# EAGLE design WaterbedSlave (EAGLE 9.1.3)
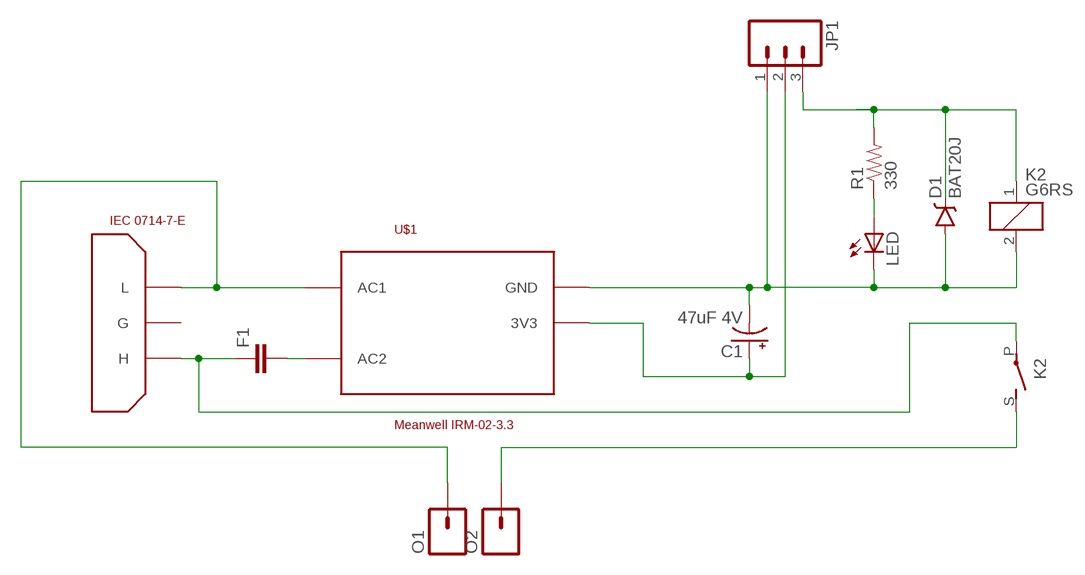
[diagram p0: schematic, sheet 1]

## Parts
C1  47uF 4V  CAP_POLPTH2  [CPOL-RADIAL-10UF-25V]
D1  BAT20J  DIODE-SCHOTTKY-BAT20J  [SOD-323]
F1  CAPPTH1  [CAP-PTH-5MM]
JP1  M03POLAR_LOCK  [MOLEX-1X3_LOCK]
K2  G6RS  [G6RS]
LED  LEDCHIPLED_0805  [CHIPLED_0805]
O1  M01PTH_2MM  [1X01_2MM]
O2  M01PTH_2MM  [1X01_2MM]
R1  330  RESISTOR0805-RES  [0805]
U$1  Meanwell IRM-02-3.3  RAC02-3.3SC  [RAC02-3.3SC]
U$3  IEC 0714-7-E  IEC  [IEC]

## Nets
3V3: C1.1(+) JP1.2 U$1.GND(3V3)
GND: C1.2(-) D1.A JP1.1 K2.2 LED.C U$1.3V3(GND)
N$1: O1.1 U$1.AC1 U$3.L
N$2: F1.2 U$1.AC2
N$3: K2.S(2:S) O2.1
N$4: F1.1 K2.P(2:P) U$3.H
N$10: LED.A R1.1
N$16: D1.C JP1.3 K2.1 R1.2
Unconnected: U$3.G

## Library data of the parts
C1 = SparkFun-Capacitors:CAP_POL: Capacitor Polarized These are standard SMD and PTH capacitors. Normally 10uF, 47uF, and 100uF in electrolytic and tantalum varieties. Always verify the external diameter of the through hole cap, it varies with capacity, voltage, and manufacturer. The EIA devices should be standard.
D1 = SparkFun-DiscreteSemi:DIODE-SCHOTTKY: Schottky diodes in SFE's production catalog BAT20J 1A 23V 0.62Vf RB751 120mA 40V 0.37Vf PMEG4005EJ 0.5A 40V 0.42Vf MBRA140 1A 40V 0.5Vf B340A 3A 40V SMA; PROD_ID: DIO-11623
F1 = SparkFun-Capacitors:CAP: Capacitor Standard 0603 ceramic capacitor, and 0.1" leaded capacitor.
JP1 = SparkFun-Connectors:M03: Header 3 Standard 3-pin 0.1" header. Use with straight break away headers (SKU : PRT-00116), right angle break away headers (PRT-00553), swiss pins (PRT-00743), machine pins (PRT-00117), and female headers (PRT-00115). Molex polarized connector foot print use with SKU : PRT-08232 with associated crimp pins and housings.
K2 = relay:G6RS: RELAY 1 x norm. open, Omron; OC_FARNELL: unknown; OC_NEWARK: unknown
LED = led:LED: LED OSRAM: - CHIPLED LG R971, LG N971, LY N971, LG Q971, LY Q971, LO R971, LY R971 LH N974, LH R974 LS Q976, LO Q976, LY Q976 LO Q996 - Hyper CHIPLED LW Q18S LB Q993, LB Q99A, LB R99A - SideLED LS A670, LO A670, LY A670, LG A670, LP A670 LB A673, LV A673, LT A673, LW A673 LH A674 LY A675 LS A676, LA A676, LO A676, LY A676, LW A676 LS A679, LY A679, LG A679 - Hyper Micro SIDELED® LS Y876, LA Y876, LO Y876, LY Y876 LT Y87S - SmartLED LW L88C, LW L88S LB L89C, LB L89S, LG L890 LS L89K, LO L89K, LY L89K LS L896, LA L896, LO L896, LY L896 - TOPLED LS T670, LO T670, LY T670, LG T670, LP T670 LSG T670, LSP T670, LSY T670, LOP T670, LYG T670 LG T671, LOG T671, LSG T671 LB T673, LV T673, LT T673, LW T673 LH T674 LS T676, LA T676, LO T676, LY T676, LB T676, LH T676, LSB T676, LW T676 LB T67C, LV T67C, LT T67C, LS T67K, LO T67K, LY T67K, LW E67C LS E67B, LA E67B, LO E67B, LY E67B, LB E67C, LV E67C, LT E67C LW T67C LS T679, LY T679, LG T679 LS T770, LO T770, LY T770, LG T770, LP T770 LB T773, LV T773, LT T773, LW T773 LH T774 LS E675, LA E675, LY E675, LS T675 LS T776, LA T776, LO T776, LY T776, LB T776 LHGB T686 LT T68C, LB T68C - Hyper Mini TOPLED® LB M676 - Mini TOPLED Santana® LG M470 LS M47K, LO M47K, LY M47K Source: http://www.osram.convergy.de LUXEON: - LUMILED® LXK2-PW12-R00, LXK2-PW12-S00, LXK2-PW14-U00, LXK2-PW14-V00 LXK2-PM12-R00, LXK2-PM12-S00, LXK2-PM14-U00 LXK2-PE12-Q00, LXK2-PE12-R00, LXK2-PE12-S00, LXK2-PE14-T00, LXK2-PE14-U00 LXK2-PB12-K00, LXK2-PB12-L00, LXK2-PB12-M00, LXK2-PB14-N00, LXK2-PB14-P00, LXK2-PB14-Q00 LXK2-PR12-L00, LXK2-PR12-M00, LXK2-PR14-Q00, LXK2-PR14-R00 LXK2-PD12-Q00, LXK2-PD12-R00, LXK2-PD12-S00 LXK2-PH12-R00, LXK2-PH12-S00 LXK2-PL12-P00, LXK2-PL12-Q00, LXK2-PL12-R00 Source: www.luxeon.com KINGBRIGHT: KA-3528ASYC Source: www.kingbright.com
O1 O2 = SparkFun-Connectors:M01: Header 1 Standard 1-pin 0.1" header. Use with straight break away headers (SKU : PRT-00116), right angle break away headers (PRT-00553), swiss pins (PRT-00743), machine pins (PRT-00117), and female headers (PRT-00115).
R1 = SparkFun-Resistors:RESISTOR: Resistor Basic schematic elements and footprints for 0603, 1206, and PTH resistors.
U$1 = CuriousTech:RAC02-3.3SC: RAC02-3.3SC
U$3 = CuriousTech:IEC: IEC Female

## Board
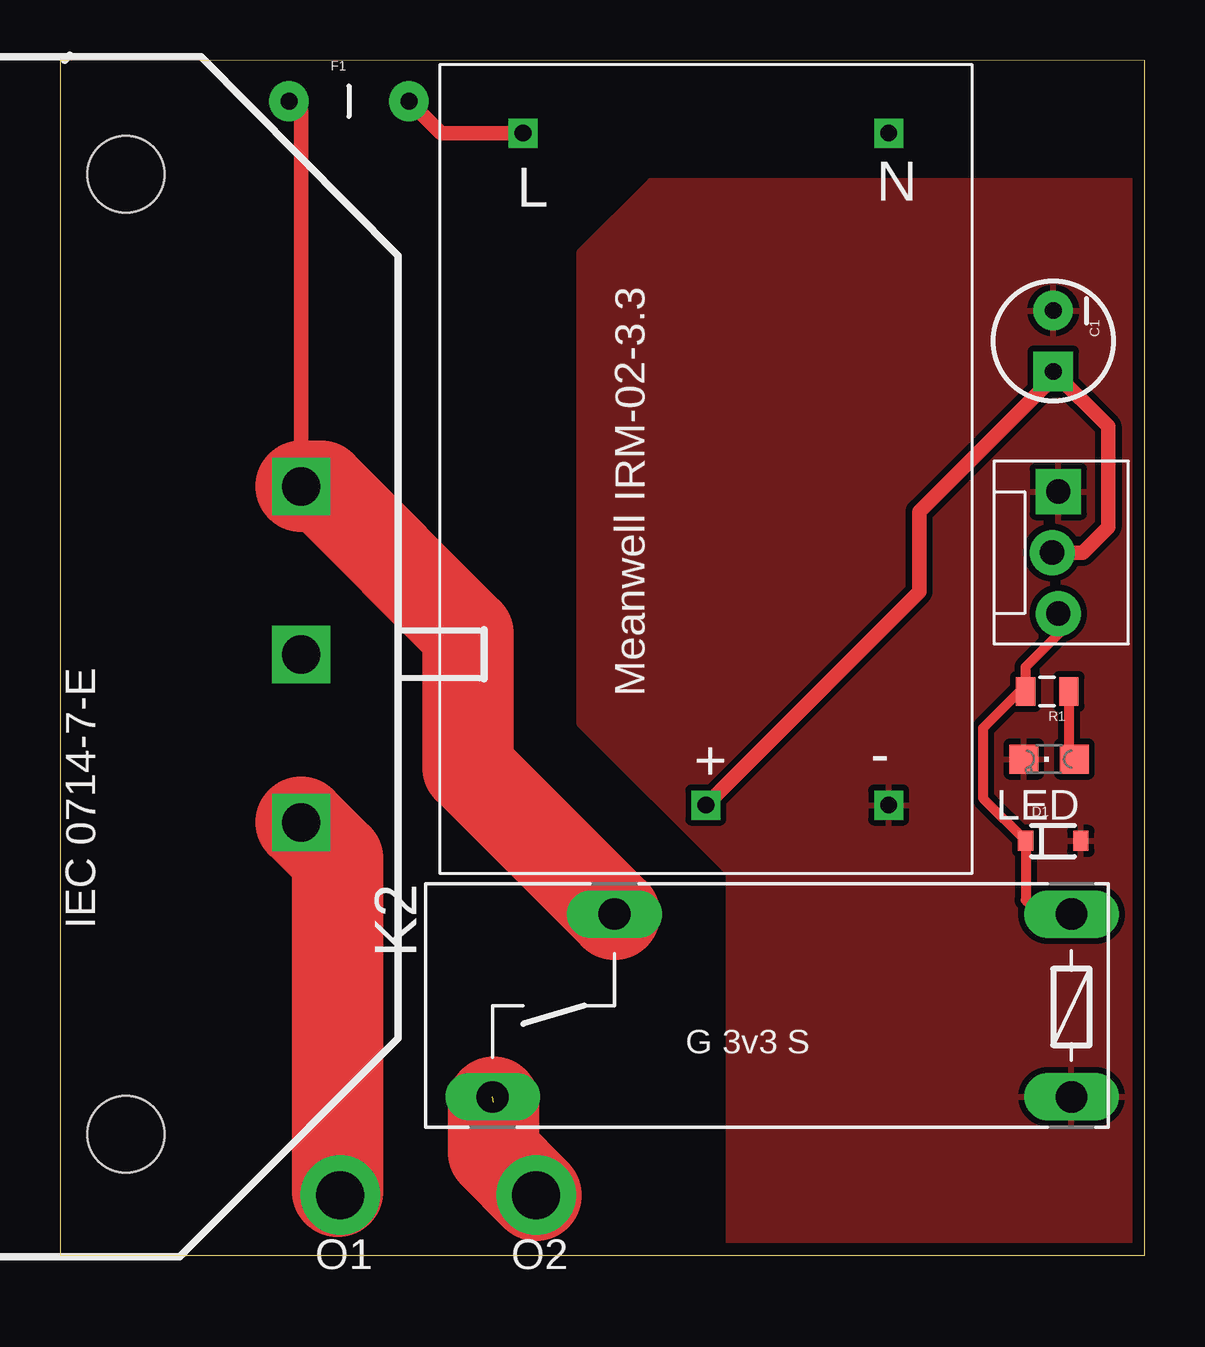
[diagram p1: board, top side]
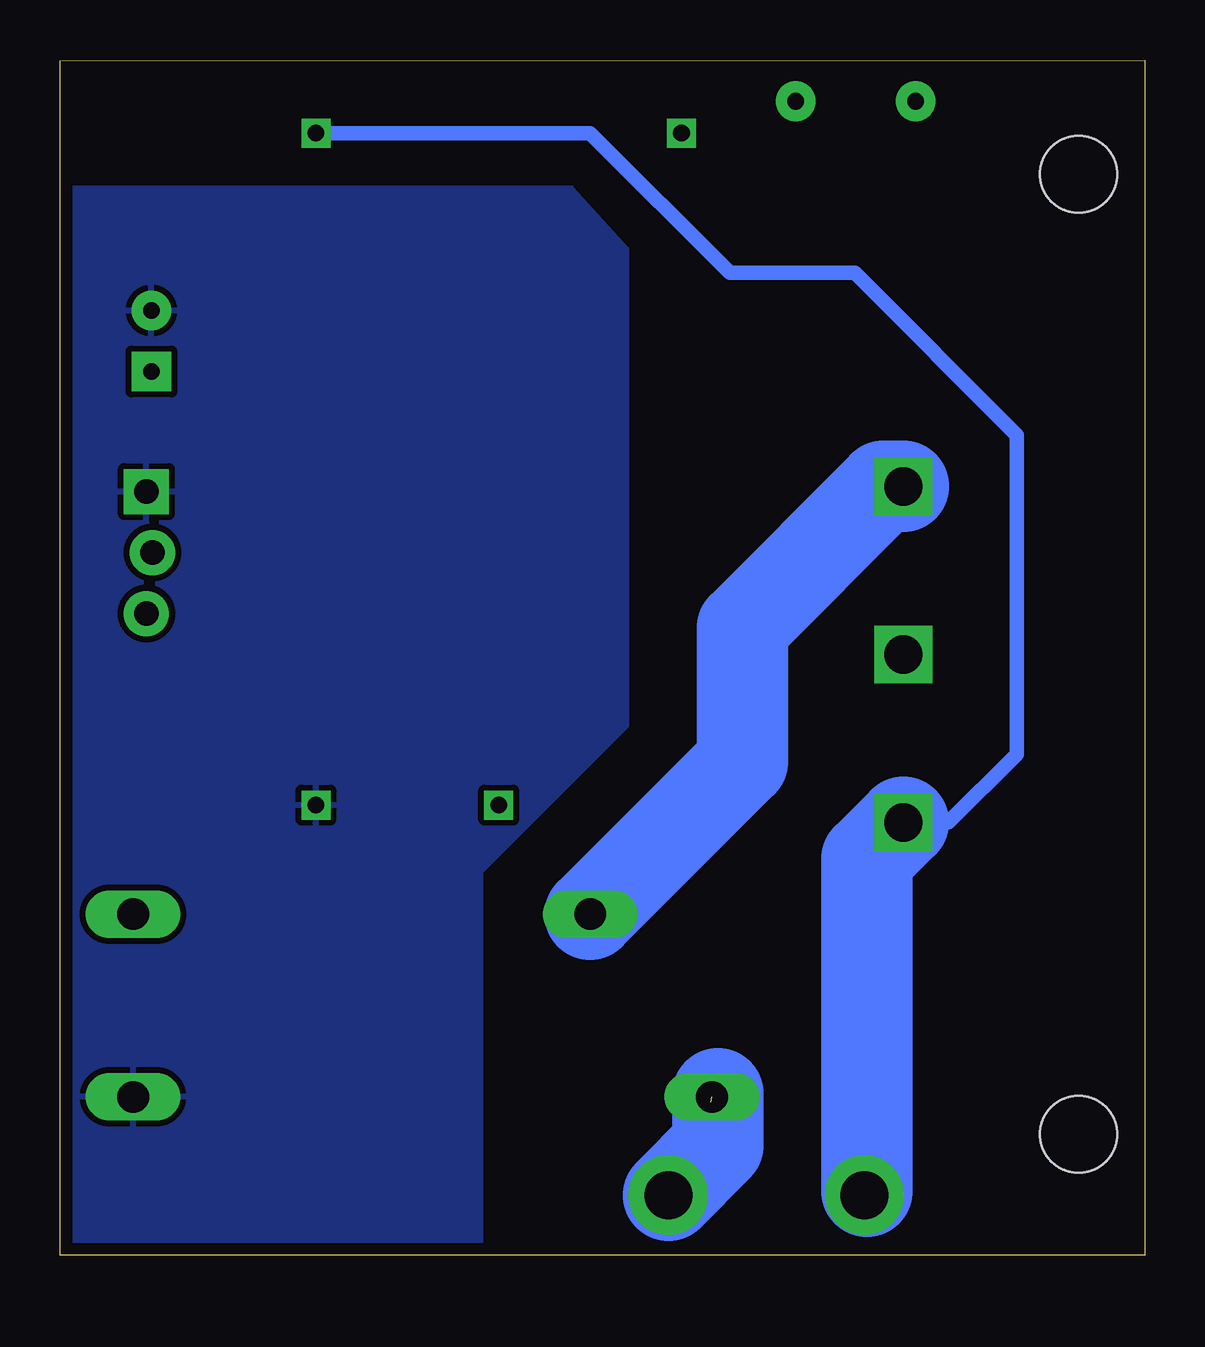
[diagram p2: board, bottom side, seen from below]

Size 45.21 x 49.81 mm. Coordinates in mm from the lower left corner, seen from the top.
Outline: 0,0 45.21,0 45.21,49.78 0,49.81 0,0
Copper layers (1*16): Top 0.035mm / dielectric 1.5mm / Bottom 0.035mm
Design rules "default *": minimum track width 10mil, minimum drill 24mil, track to track 8mil, track to pad 8mil, pad to pad 8mil, via to via 8mil, smd to smd 8mil, copper to edge 20mil, drill to drill 8mil, minimum pad ring 10mil, minimum via ring 8mil, stop-mask expansion 4mil, vias tented up to drill 0mil, thermal gap 10mil

### Footprints (pad centres in the part's own frame; a part is rotated, then mirrored left to right if it is on the bottom)
CPOL-RADIAL-10UF-25V = drill 0.7 pad 1.651 square: 1 1.27,0 | drill 0.7 pad 1.651: 2 -1.27,0
SOD-323 = smd 0.63 x 0.83: A 1.15,0; C -1.15,0
CAP-PTH-5MM = drill 0.7 pad 1.651: 1 -2.5,0; 2 2.5,0
MOLEX-1X3_LOCK = drill 1.016 pad 1.88 square: 1 0,0.127 | drill 1.016 pad 1.88: 2 2.54,-0.127; 3 5.08,0.127
G6RS = drill 1.321 long: 1 -12.7,-3.81; 2 -12.7,3.81; P 6.35,-3.81; S 11.43,3.81
CHIPLED_0805 = smd 1.2 x 1.2: A 0,-1.05; C 0,1.05
1X01_2MM = drill 2 pad 3.302: 1 0,0
0805 = smd 0.8 x 1.2: 1 -0.9,0; 2 0.9,0
RAC02-3.3SC = drill 0.7 square: 3V3 14,7.62; AC1 -14,7.62; AC2 -14,-7.62; GND 14,0
IEC = drill 1.6 square: G 7.3,0; H 7.3,7; L 7.3,-7 | hole 3.2: 0,20; 0,-20

### Placement (x,y rotation side)
C1  41.4,38.1 270 top
D1  41.4,17.27 0 top
F1  12.05,48.09 0 top
JP1  41.49,31.82 270 top
K2  29.46,10.41 180 top
LED  41.23,20.68 90 top
O1  11.68,2.51 180 top
O2  19.85,2.51 180 top
R1  41.15,23.5 180 top
U$1  26.92,32.77 270 top
U$3  2.75,25.05 0 top

### Tracks (layer width: path | path; a pad name or v marks a point on that pad's centre or on a via)
3V3
  Top 0.61: U$1.GND 35.81,27.66 35.81,30.99 41.4,36.58 C1.1 43.69,34.54 43.69,30.34 42.63,29.28 JP1.2
GND
  pour Top (isolate 0.254): 27.86,0 45.29,0 45.29,44.77 24.61,44.77 21.64,41.79 21.64,22.15 27.86,15.94
  pour Bottom (isolate 0.254): 27.69,0.25 27.69,16 21.59,22.1 21.59,38.26 21.59,40.64 21.59,41.91 23.91,44.45 45.25,44.45 45.25,0 28.19,-0.25
N$1
  Top 3.81: 11.58,2.67 11.58,16.52 U$3.L
  Bottom 0.406: 11.58,2.67 11.68,2.67 O1.1
  Bottom 0.61: U$3.L 8.18,18.05 5.33,20.89 5.33,34.18 12.09,40.94 17.28,40.94 23.11,46.77 U$1.AC1
  Bottom 3.81: 11.58,2.67 11.58,16.52 U$3.L
N$2
  Top 0.61: U$1.AC2 15.9,46.77 15.85,46.79 F1.2
N$3  (1 unrouted)
  Top 3.81: 18.08,6.38 18.08,4.29 O2.1
  Bottom 3.81: 17.78,6.73 17.78,4.59 O2.1
N$4
  Top 0.61: U$3.H 10.05,47.67 9.64,48.09 F1.1
  Top 3.81: U$3.H 10.88,32.05 17.02,25.91 17.02,20.32 K2.P
  Bottom 3.81: U$3.H 10.88,32.05 16.76,26.16 16.76,20.57 K2.P
N$10
  Top 0.406: R1.1 42.05,20.91 LED.A
N$16
  Top 0.406: JP1.3 41.61,25.88 40.25,24.51 R1.2 39.99,23.5 38.47,21.97 38.47,19.05 D1.C 40.25,14.8 40.64,14.48 40.95,14.22 K2.1

### Text on the board
tPlace: L | N | + | - | G 3v3 S
bStop: CuriousTech.net | WiFi Waterbed Heater Slave